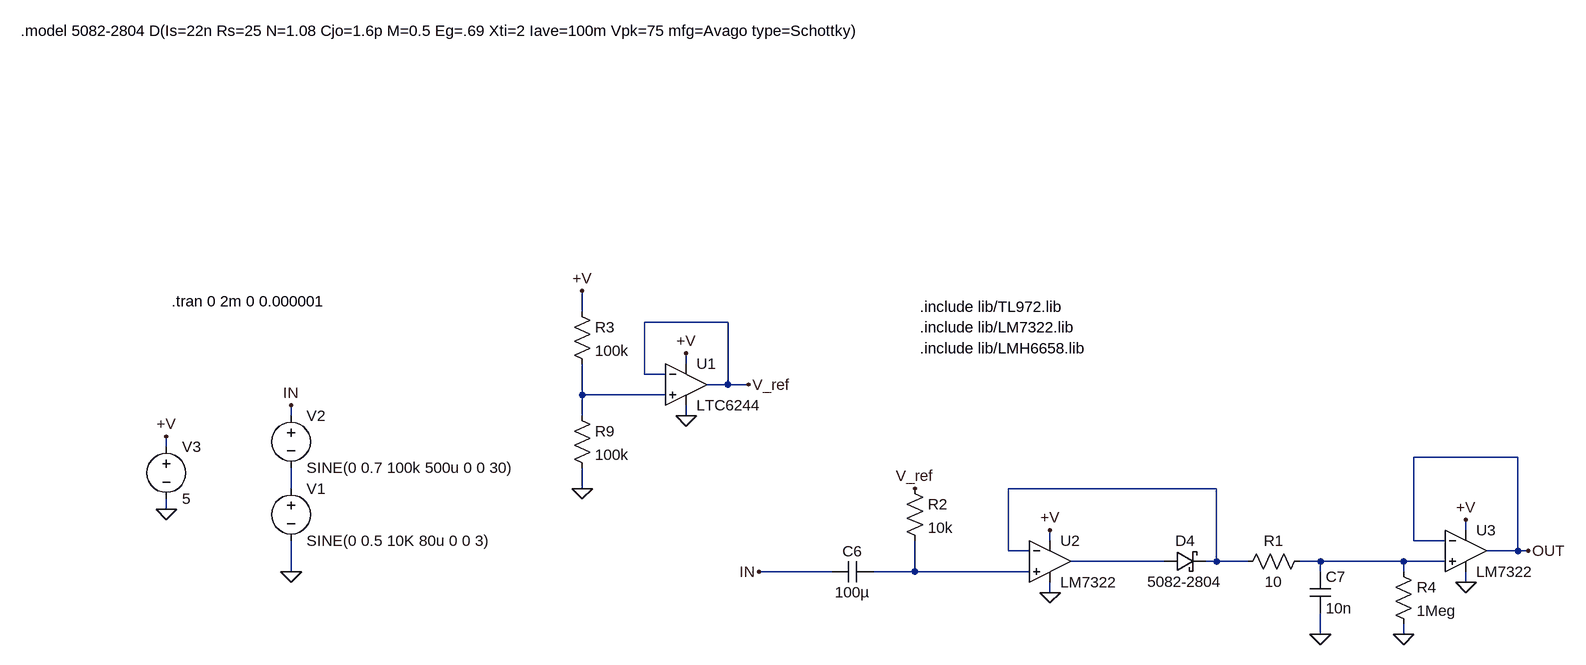
[diagram p0: schematic improved_peak_detector.asc]
improved_peak_detector.asc, the LTspice schematic file:
Version 4
SHEET 1 880 1712
WIRE -2304 64 -2304 32
WIRE -2080 80 -2208 80
WIRE -2144 144 -2144 128
WIRE -2208 160 -2208 80
WIRE -2176 160 -2208 160
WIRE -2080 176 -2080 80
WIRE -2080 176 -2112 176
WIRE -2048 176 -2080 176
WIRE -2304 192 -2304 144
WIRE -2176 192 -2304 192
WIRE -2752 224 -2752 208
WIRE -2304 224 -2304 192
WIRE -2144 224 -2144 208
WIRE -2944 272 -2944 256
WIRE -864 288 -1024 288
WIRE -2752 336 -2752 304
WIRE -2304 336 -2304 304
WIRE -1328 336 -1648 336
WIRE -2944 368 -2944 352
WIRE -944 400 -944 384
WIRE -1584 416 -1584 400
WIRE -1024 416 -1024 288
WIRE -976 416 -1024 416
WIRE -1648 432 -1648 336
WIRE -1616 432 -1648 432
WIRE -864 432 -864 288
WIRE -864 432 -912 432
WIRE -848 432 -864 432
WIRE -1408 448 -1552 448
WIRE -1328 448 -1328 336
WIRE -1328 448 -1344 448
WIRE -1280 448 -1328 448
WIRE -1168 448 -1200 448
WIRE -1040 448 -1168 448
WIRE -976 448 -1040 448
WIRE -2752 464 -2752 416
WIRE -1920 464 -2032 464
WIRE -1792 464 -1792 416
WIRE -1792 464 -1856 464
WIRE -1616 464 -1792 464
WIRE -1168 464 -1168 448
WIRE -1040 464 -1040 448
WIRE -944 480 -944 464
WIRE -1584 496 -1584 480
WIRE -1168 560 -1168 528
WIRE -1040 560 -1040 544
FLAG -2752 208 IN
FLAG -2944 368 0
FLAG -2944 256 +V
FLAG -2752 464 0
FLAG -2304 336 0
FLAG -2048 176 V_ref
FLAG -2144 224 0
FLAG -2144 128 +V
FLAG -2304 32 +V
FLAG -1584 496 0
FLAG -1584 400 +V
FLAG -2032 464 IN
FLAG -944 480 0
FLAG -848 432 OUT
FLAG -944 384 +V
FLAG -1168 560 0
FLAG -1792 336 V_ref
FLAG -1040 560 0
SYMBOL voltage -2752 320 R0
WINDOW 123 0 0 Left 2
WINDOW 39 0 0 Left 2
SYMATTR InstName V1
SYMATTR Value SINE(0 0.5 10K 80u 0 0 3)
SYMBOL voltage -2752 208 R0
WINDOW 123 0 0 Left 2
WINDOW 39 0 0 Left 2
SYMATTR InstName V2
SYMATTR Value SINE(0 0.7 100k 500u 0 0 30)
SYMBOL voltage -2944 256 R0
WINDOW 123 0 0 Left 2
WINDOW 39 0 0 Left 2
SYMATTR InstName V3
SYMATTR Value 5
SYMBOL res -2320 48 R0
SYMATTR InstName R3
SYMATTR Value 100k
SYMBOL res -2320 208 R0
SYMATTR InstName R9
SYMATTR Value 100k
SYMBOL Opamps\\LTC6244 -2144 176 R0
SYMATTR InstName U1
SYMBOL schottky -1408 464 R270
WINDOW 0 32 32 VTop 2
WINDOW 3 0 32 VBottom 2
SYMATTR InstName D4
SYMATTR Value 5082-2804
SYMATTR Description Diode
SYMATTR Type diode
SYMBOL cap -1920 480 R270
WINDOW 0 32 32 VTop 2
WINDOW 3 0 32 VBottom 2
SYMATTR InstName C6
SYMATTR Value 100µ
SYMBOL cap -1184 464 R0
SYMATTR InstName C7
SYMATTR Value 10n
SYMBOL res -1184 432 R90
WINDOW 0 0 56 VBottom 2
WINDOW 3 32 56 VTop 2
SYMATTR InstName R1
SYMATTR Value 10
SYMBOL Opamps\\opamp2 -1584 384 R0
SYMATTR InstName U2
SYMATTR Value LM7322
SYMBOL Opamps\\opamp2 -944 368 R0
SYMATTR InstName U3
SYMATTR Value LM7322
SYMBOL res -1808 320 R0
SYMATTR InstName R2
SYMATTR Value 10k
SYMBOL res -1056 448 R0
SYMATTR InstName R4
SYMATTR Value 1Meg
TEXT -3168 -368 Left 2 !.model 5082-2804 D(Is=22n Rs=25 N=1.08 Cjo=1.6p M=0.5 Eg=.69 Xti=2 Iave=100m Vpk=75 mfg=Avago type=Schottky)
TEXT -2936 48 Left 2 !.tran 0 2m 0 0.000001
TEXT -1784 120 Left 2 !.include lib/LMH6658.lib
TEXT -1784 88 Left 2 !.include lib/LM7322.lib
TEXT -1784 56 Left 2 !.include lib/TL972.lib

The netlist it stands for:
* improved_peak_detector.asc
V1 N002 0 SINE(0 0.5 10K 80u 0 0 3)
V2 IN N002 SINE(0 0.7 100k 500u 0 0 30)
V3 +V 0 5
R3 +V N001 100k
R9 N001 0 100k
XU1 N001 V_ref +V 0 V_ref LTC6244  ; pins In+ In- V+ V- OUT
D4 N004 N003 5082-2804
C6 IN N006 100µ
C7 N005 0 10n
R1 N005 N003 10
XU2 N006 N003 +V 0 N004 LM7322  ; pins In+ In- V+ V- OUT
XU3 N005 OUT +V 0 OUT LM7322  ; pins In+ In- V+ V- OUT
R2 V_ref N006 10k
R4 N005 0 1Meg
.model D D
.lib standard.dio
.model 5082-2804 D(Is=22n Rs=25 N=1.08 Cjo=1.6p M=0.5 Eg=.69 Xti=2 Iave=100m Vpk=75 mfg=Avago type=Schottky)
.tran 0 2m 0 0.000001
.include lib/LMH6658.lib
.include lib/LM7322.lib
.include lib/TL972.lib
.backanno
.end